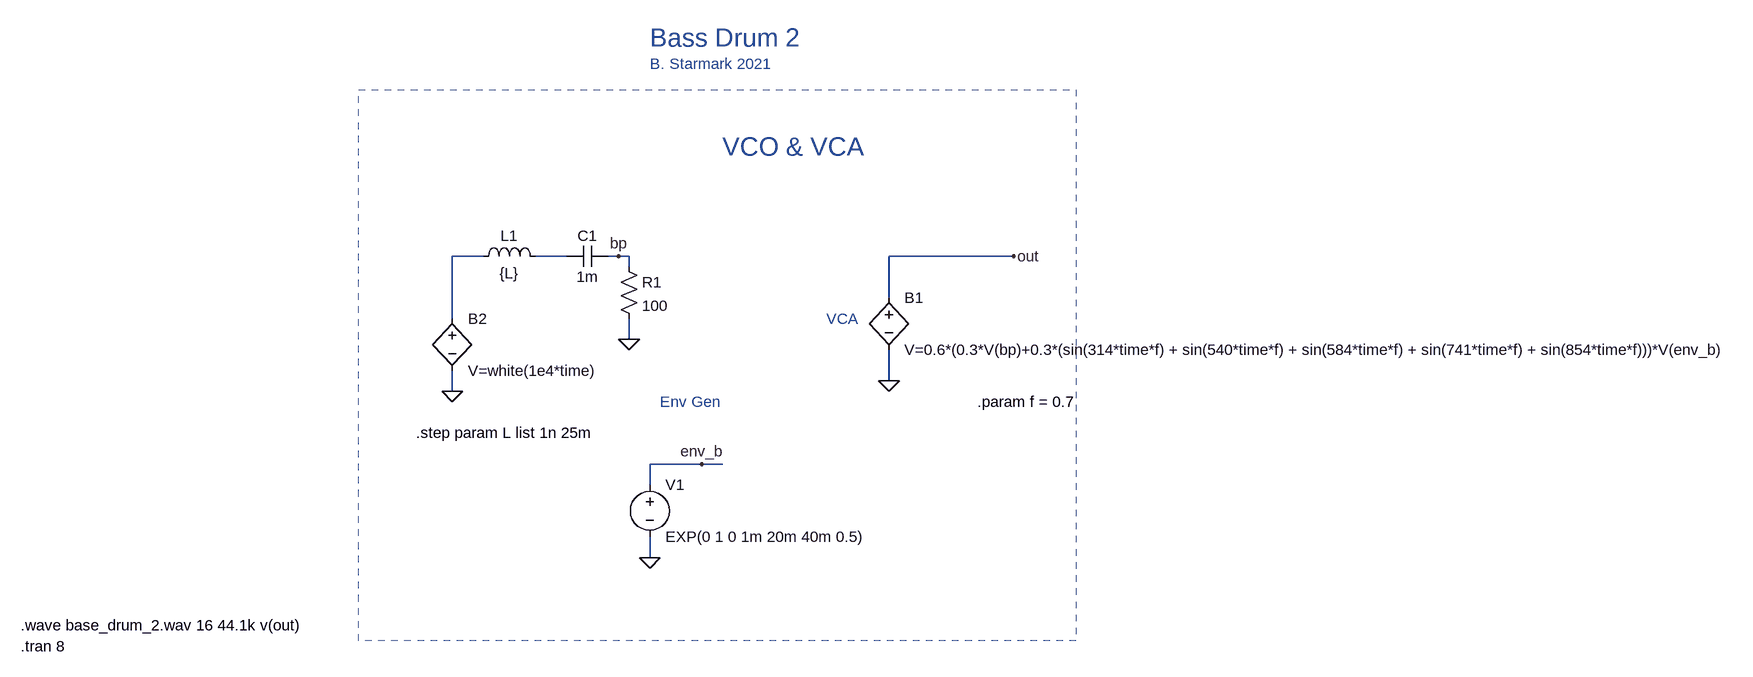
[diagram p0: schematic bass_drum_2.asc]
bass_drum_2.asc, the LTspice schematic file:
Version 4
SHEET 1 1536 2476
WIRE -1712 -752 -1760 -752
WIRE -1584 -752 -1632 -752
WIRE -1504 -752 -1520 -752
WIRE -1488 -752 -1504 -752
WIRE -896 -752 -1088 -752
WIRE -1488 -736 -1488 -752
WIRE -1088 -688 -1088 -752
WIRE -1760 -656 -1760 -752
WIRE -1488 -624 -1488 -656
WIRE -1088 -560 -1088 -608
WIRE -1760 -544 -1760 -576
WIRE -1376 -432 -1456 -432
WIRE -1344 -432 -1376 -432
WIRE -1456 -400 -1456 -432
WIRE -1456 -288 -1456 -320
FLAG -1088 -560 0
FLAG -896 -752 out
FLAG -1456 -288 0
FLAG -1376 -432 env_b
FLAG -1760 -544 0
FLAG -1488 -624 0
FLAG -1504 -752 bp
SYMBOL bv -1088 -704 R0
SYMATTR InstName B1
SYMATTR Value V=0.6*(0.3*V(bp)+0.3*(sin(314*time*f) + sin(540*time*f) + sin(584*time*f) + sin(741*time*f) + sin(854*time*f)))*V(env_b)
SYMBOL voltage -1456 -416 R0
WINDOW 123 0 0 Left 0
WINDOW 39 0 0 Left 0
SYMATTR InstName V1
SYMATTR Value EXP(0 1 0 1m 20m 40m 0.5)
SYMBOL bv -1760 -672 R0
SYMATTR InstName B2
SYMATTR Value V=white(1e4*time)
SYMBOL ind -1728 -736 R270
WINDOW 0 32 56 VTop 2
WINDOW 3 5 56 VBottom 2
SYMATTR InstName L1
SYMATTR Value {L}
SYMBOL cap -1520 -768 R90
WINDOW 0 0 32 VBottom 2
WINDOW 3 32 32 VTop 2
SYMATTR InstName C1
SYMATTR Value 1m
SYMBOL res -1504 -752 R0
SYMATTR InstName R1
SYMATTR Value 100
TEXT -1456 -1088 Left 4 ;Bass Drum 2
TEXT -1184 -656 Left 2 ;VCA
TEXT -1440 -528 Left 2 ;Env Gen
TEXT -1456 -1048 Left 2 ;B. Starmark 2021
TEXT -1344 -920 Left 4 ;VCO & VCA
TEXT -2424 -152 Left 2 !.tran 8
TEXT -2424 -184 Left 2 !.wave base_drum_2.wav 16 44.1k v(out)
TEXT -952 -528 Left 2 !.param f = 0.7
TEXT -1816 -480 Left 2 !.step param L list 1n 25m
RECTANGLE Normal -800 -160 -1904 -1008 2

The netlist it stands for:
* bass_drum_2.asc
B1 out 0 V=0.6*(0.3*V(bp)+0.3*(sin(314*time*f) + sin(540*time*f) + sin(584*time*f) + sin(741*time*f) + sin(854*time*f)))*V(env_b)
V1 env_b 0 EXP(0 1 0 1m 20m 40m 0.5)
B2 N001 0 V=white(1e4*time)
L1 N001 N002 {L}
C1 bp N002 1m
R1 bp 0 100
* Bass Drum 2
* VCA
* Env Gen
* B. Starmark 2021
* VCO & VCA
.tran 8
.wave base_drum_2.wav 16 44.1k v(out)
.param f = 0.7
.step param L list 1n 25m
.backanno
.end